# EAGLE schematic MMU_V101r4 (EAGLE 6.6.0)

## Sheet 1 of 4
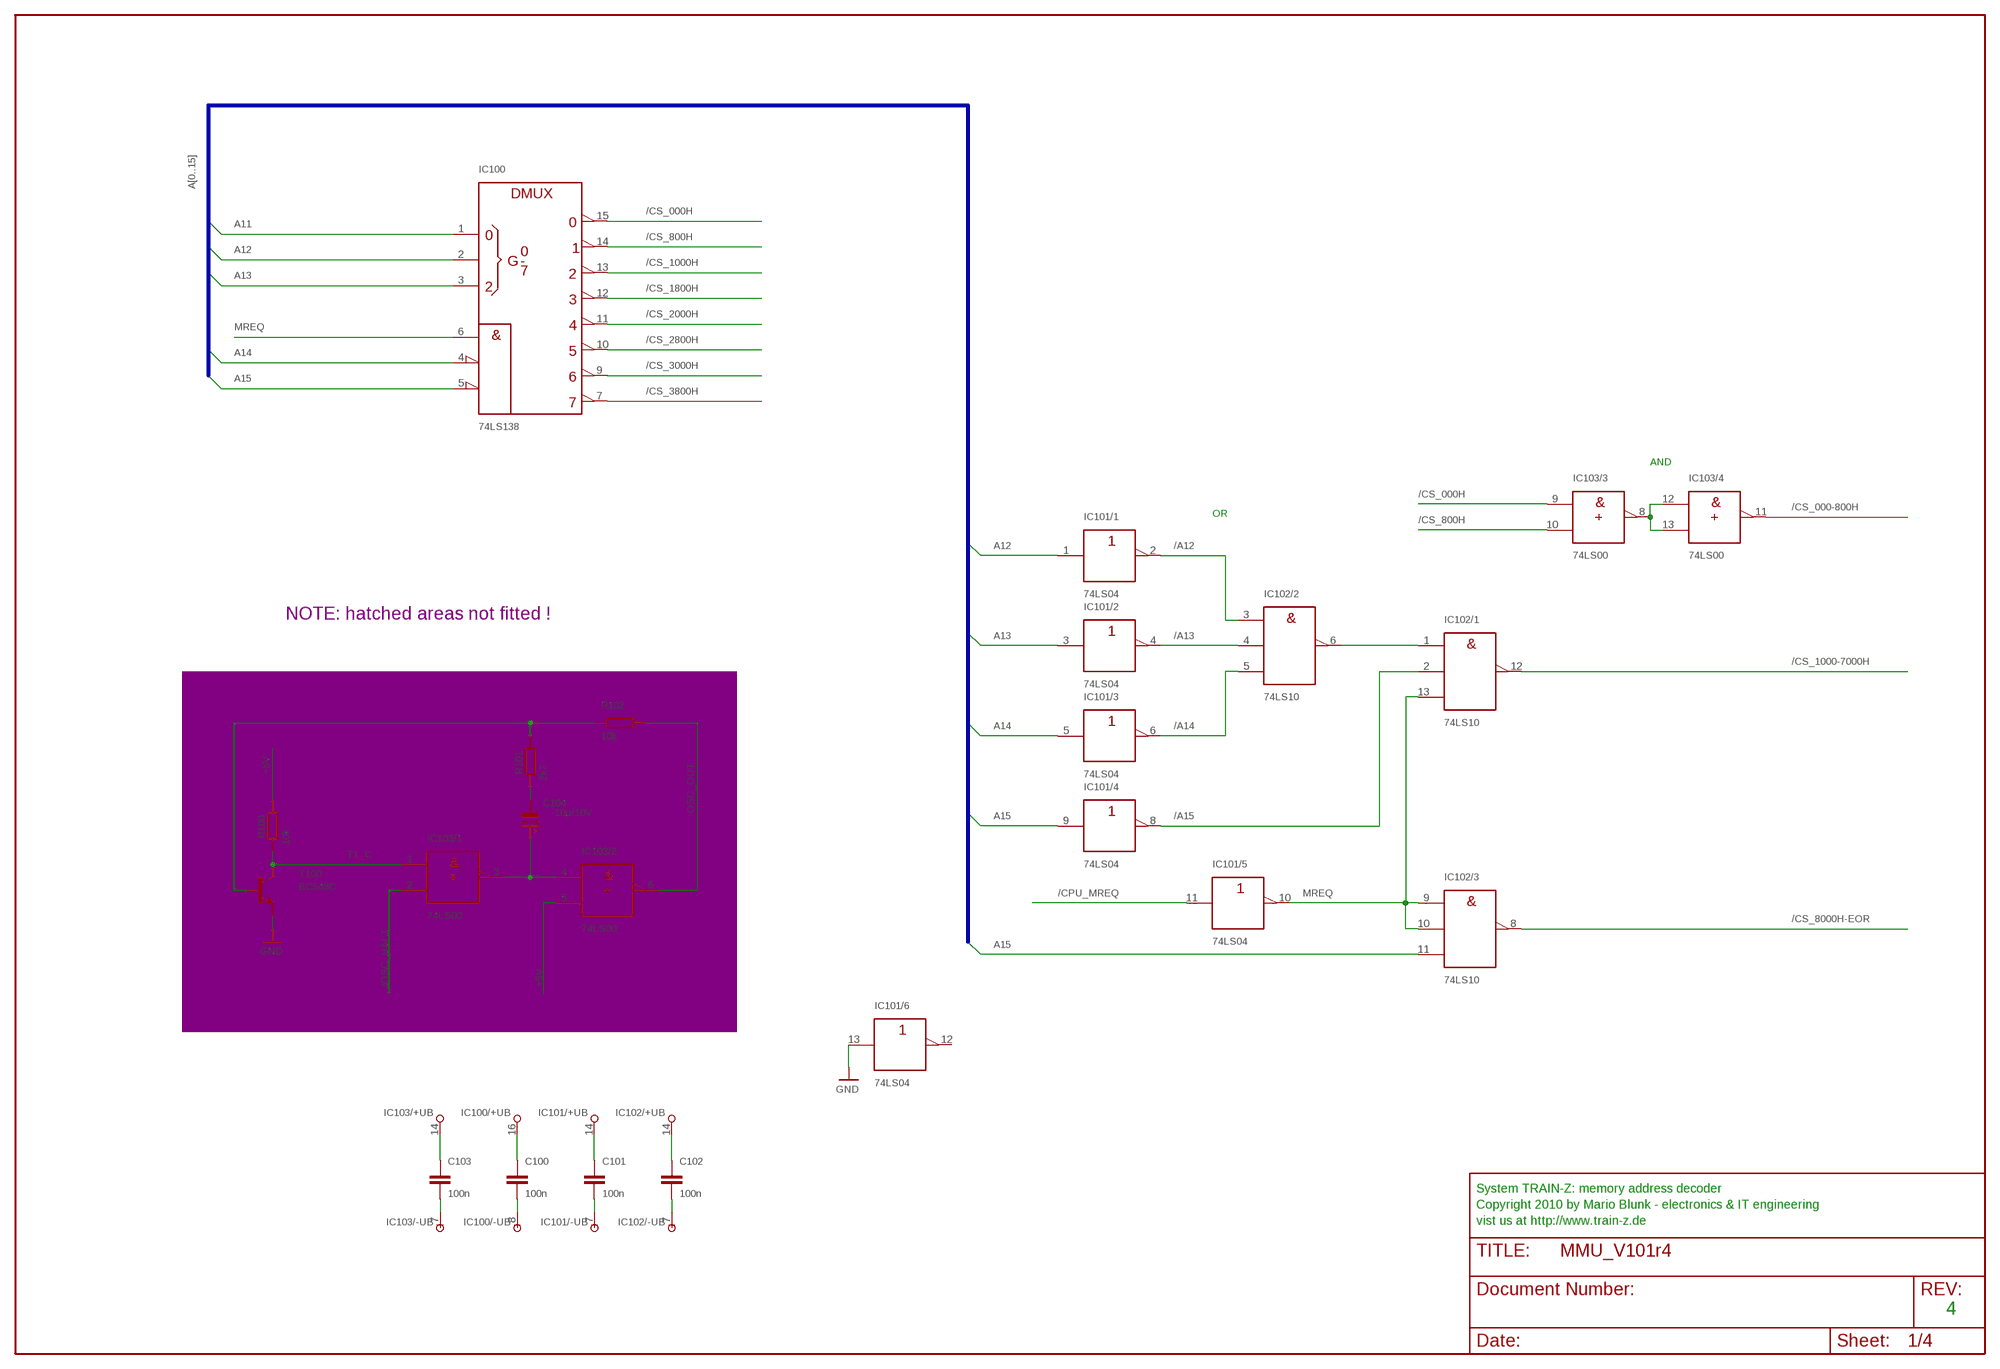
[diagram p0: schematic, sheet 1]

### Parts
C100  100n  C-EU050-030X075  [C050-030X075]
C101  100n  C-EU050-030X075  [C050-030X075]
C102  100n  C-EU050-030X075  [C050-030X075]
C103  100n  C-EU050-030X075  [C050-030X075]
C104  10µ/10V  CPOL-EUE2.5-7  [E2,5-7]
IC100  74LS138  74138N  [DIL16]
IC101  74LS04  7404N  [DIL14]
IC102  74LS10  7410N  [DIL14]
IC103  74LS00  74LS00N  [DIL14]
R100  10k  R-EU_0207/10  [0207/10]
R101  2k7  R-EU_0207/10  [0207/10]
R102  10k  R-EU_0207/10  [0207/10]
T100  BC548C  BC547  [TO92]

### Nets
+5V [+5V]: C100.1 C101.1 C102.1 C103.1 IC100.16(+UB) IC101.14(/+UB:+UB) IC102.14(/+UB:+UB) IC103.5(/2:B) IC103.14(/+UB:+UB) R100.2 ; also sheet 2,3,4
/A12: IC101.2(/1:Y) IC102.3(/2:A)
/A13: IC101.4(/2:Y) IC102.4(/2:B)
/A14: IC101.6(/3:Y) IC102.5(/2:C)
/A15: IC101.8(/4:Y) IC102.2(/1:B)
/CPU_MREQ: IC101.11(/5:A) ; also sheet 3,4
/CS_000-800H: IC103.11(/4:Y) ; also sheet 2,3,4
/CS_000H: IC100.15(Y0) IC103.9(/3:A)
/CS_800H: IC100.14(Y1) IC103.10(/3:B)
/CS_1000-7000H: IC102.12(/1:Y) ; also sheet 2,3,4
/CS_1000H: IC100.13(Y2)
/CS_1800H: IC100.12(Y3)
/CS_2000H: IC100.11(Y4)
/CS_2800H: IC100.10(Y5)
/CS_3000H: IC100.9(Y6)
/CS_3800H: IC100.7(Y7)
/CS_8000H-EOR: IC102.8(/3:Y) ; also sheet 2,3,4
/OSC_HALT: IC103.2(/1:B) ; also sheet 3,4
A11: IC100.1(A) ; also sheet 2,3,4
A12: IC100.2(B) IC101.1(/1:A) ; also sheet 2,3,4
A12ORA13ORA14: IC102.1(/1:A) IC102.6(/2:Y)
A13: IC100.3(C) IC101.3(/2:A) ; also sheet 2,3,4
A14: IC100.4(!G2A) IC101.5(/3:A) ; also sheet 2,3,4
A15: IC100.5(!G2B) IC101.9(/4:A) IC102.11(/3:C) ; also sheet 3,4
C14+: C104.+ IC103.3(/1:Y) IC103.4(/2:A)
C14-: C104.- R101.1
CS_000-800H: IC103.8(/3:Y) IC103.12(/4:A) IC103.13(/4:B)
GND [GND]: C100.2 C101.2 C102.2 C103.2 IC100.8(-UB) IC101.7(/-UB:-UB) IC101.13(/6:A) IC102.7(/-UB:-UB) IC103.7(/-UB:-UB) T100.1(E) ; also sheet 2,3,4
MREQ: IC100.6(G1) IC101.10(/5:Y) IC102.9(/3:A) IC102.10(/3:B) IC102.13(/1:C)
OSC_OUT: IC103.6(/2:Y) R102.2 ; also sheet 3,4
T1_B: R101.2 R102.1 T100.2(B)
T1_C: IC103.1(/1:A) R100.1 T100.3(C)
Unconnected: IC101.12(/6:Y)

### Buses
A[0..15]

### Notes on the sheet
- AND
- OR
- NOTE: hatched areas not fitted !
- System TRAIN-Z: memory address decoder
- Copyright 2010 by Mario Blunk - electronics & IT engineering
- vist us at http://www.train-z.de
- 4

## Sheet 2 of 4
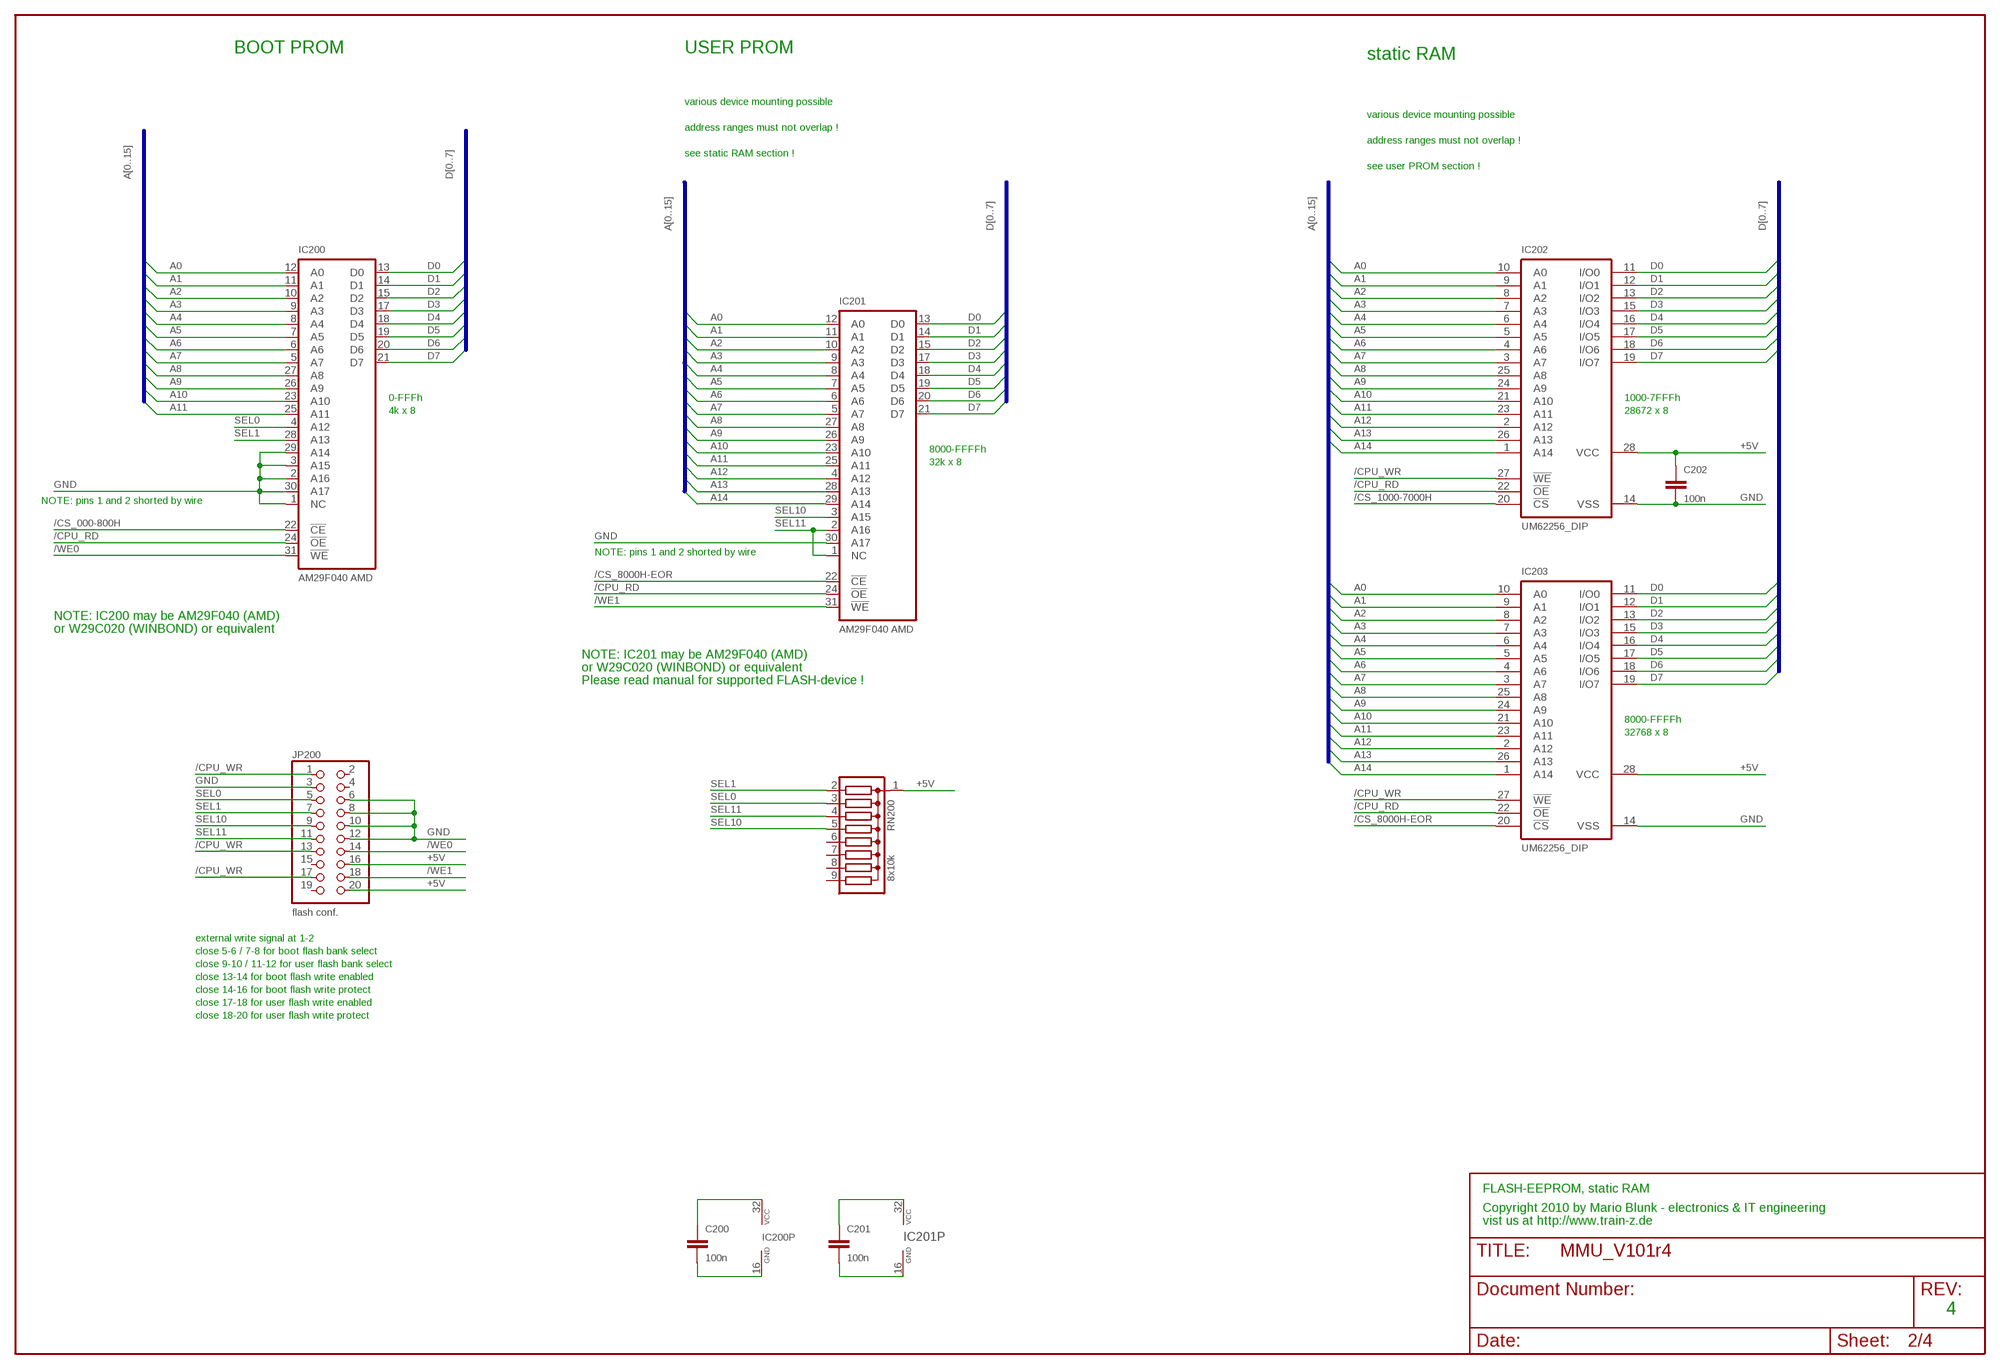
[diagram p1: schematic, sheet 2]

### Parts
C200  100n  C-EU050-030X075  [C050-030X075]
C201  100n  C-EU050-030X075  [C050-030X075]
C202  100n  C-EU050-030X075  [C050-030X075]
IC200  AM29F040 AMD  W29C020  [DIL32]
IC201  AM29F040 AMD  W29C020  [DIL32]
IC202  UM62256_DIP  62256P  [DIL28-6]
IC203  UM62256_DIP  62256P  [DIL28-6]
JP200  flash conf.  PINHD-2X10  [2X10]
RN200  8x10k  G08R  [SIL9]

### Nets
+5V [+5V]: C200.1 C201.1 C202.1 IC200.32(VCC) IC201.32(VCC) IC202.28(VCC) IC203.28(VCC) JP200.16 JP200.20 RN200.1 ; also sheet 1,3,4
/CPU_RD: IC200.24(!OE) IC201.24(!OE) IC202.22(!OE) IC203.22(!OE) ; also sheet 3,4
/CPU_WR: IC202.27(!WE) IC203.27(!WE) JP200.1 JP200.13 JP200.17 ; also sheet 3,4
/CS_000-800H: IC200.22(!CE) ; also sheet 1,3,4
/CS_1000-7000H: IC202.20(!CS) ; also sheet 1,3,4
/CS_8000H-EOR: IC201.22(!CE) IC203.20(!CS) ; also sheet 1,3,4
/WE0: IC200.31(!WE) JP200.14
/WE1: IC201.31(!WE) JP200.18
A0: IC200.12(A0) IC201.12(A0) IC202.10(A0) IC203.10(A0) ; also sheet 3,4
A1: IC200.11(A1) IC201.11(A1) IC202.9(A1) IC203.9(A1) ; also sheet 3,4
A2: IC200.10(A2) IC201.10(A2) IC202.8(A2) IC203.8(A2) ; also sheet 3,4
A3: IC200.9(A3) IC201.9(A3) IC202.7(A3) IC203.7(A3) ; also sheet 3,4
A4: IC200.8(A4) IC201.8(A4) IC202.6(A4) IC203.6(A4) ; also sheet 3,4
A5: IC200.7(A5) IC201.7(A5) IC202.5(A5) IC203.5(A5) ; also sheet 3,4
A6: IC200.6(A6) IC201.6(A6) IC202.4(A6) IC203.4(A6) ; also sheet 3,4
A7: IC200.5(A7) IC201.5(A7) IC202.3(A7) IC203.3(A7) ; also sheet 3,4
A8: IC200.27(A8) IC201.27(A8) IC202.25(A8) IC203.25(A8) ; also sheet 3,4
A9: IC200.26(A9) IC201.26(A9) IC202.24(A9) IC203.24(A9) ; also sheet 3,4
A10: IC200.23(A10) IC201.23(A10) IC202.21(A10) IC203.21(A10) ; also sheet 3,4
A11: IC200.25(A11) IC201.25(A11) IC202.23(A11) IC203.23(A11) ; also sheet 1,3,4
A12: IC201.4(A12) IC202.2(A12) IC203.2(A12) ; also sheet 1,3,4
A13: IC201.28(A13) IC202.26(A13) IC203.26(A13) ; also sheet 1,3,4
A14: IC201.29(A14) IC202.1(A14) IC203.1(A14) ; also sheet 1,3,4
D0: IC200.13(D0) IC201.13(D0) IC202.11(I/O0) IC203.11(I/O0) ; also sheet 3,4
D1: IC200.14(D1) IC201.14(D1) IC202.12(I/O1) IC203.12(I/O1) ; also sheet 3,4
D2: IC200.15(D2) IC201.15(D2) IC202.13(I/O2) IC203.13(I/O2) ; also sheet 3,4
D3: IC200.17(D3) IC201.17(D3) IC202.15(I/O3) IC203.15(I/O3) ; also sheet 3,4
D4: IC200.18(D4) IC201.18(D4) IC202.16(I/O4) IC203.16(I/O4) ; also sheet 3,4
D5: IC200.19(D5) IC201.19(D5) IC202.17(I/O5) IC203.17(I/O5) ; also sheet 3,4
D6: IC200.20(D6) IC201.20(D6) IC202.18(I/O6) IC203.18(I/O6) ; also sheet 3,4
D7: IC200.21(D7) IC201.21(D7) IC202.19(I/O7) IC203.19(I/O7) ; also sheet 3,4
GND [GND]: C200.2 C201.2 C202.2 IC200.1(NC) IC200.2(A16) IC200.3(A15) IC200.16(GND) IC200.29(A14) IC200.30(A17) IC201.16(GND) IC201.30(A17) IC202.14(VSS) IC203.14(VSS) JP200.3 JP200.6 JP200.8 JP200.10 JP200.12 ; also sheet 1,3,4
SEL0: IC200.4(A12) JP200.5 RN200.3
SEL1: IC200.28(A13) JP200.7 RN200.2
SEL10: IC201.3(A15) JP200.9 RN200.5
SEL11: IC201.1(NC) IC201.2(A16) JP200.11 RN200.4
Unconnected: JP200.2 JP200.4 JP200.15 JP200.19 RN200.6 RN200.7 RN200.8 RN200.9

### Buses
A[0..15]
D[0..7]

### Notes on the sheet
- BOOT PROM | USER PROM
- static RAM
- various device mounting possible
- various device mounting possible
- address ranges must not overlap !
- address ranges must not overlap !
- see static RAM section !
- see user PROM section !
- 0-FFFh | 1000-7FFFh
- 4k x 8 | 28672 x 8
- 8000-FFFFh
- 32k x 8
- NOTE: pins 1 and 2 shorted by wire
- NOTE: pins 1 and 2 shorted by wire
- NOTE: IC200 may be AM29F040 (AMD)
- or W29C020 (WINBOND) or equivalent
- NOTE: IC201 may be AM29F040 (AMD)
- or W29C020 (WINBOND) or equivalent
- Please read manual for supported FLASH-device !
- 8000-FFFFh
- 32768 x 8
- external write signal at 1-2
- close 5-6 / 7-8 for boot flash bank select
- close 9-10 / 11-12 for user flash bank select
- close 13-14 for boot flash write enabled
- close 14-16 for boot flash write protect
- close 17-18 for user flash write enabled
- close 18-20 for user flash write protect
- FLASH-EEPROM, static RAM
- Copyright 2010 by Mario Blunk - electronics & IT engineering
- vist us at http://www.train-z.de
- 4

## Sheet 3 of 4
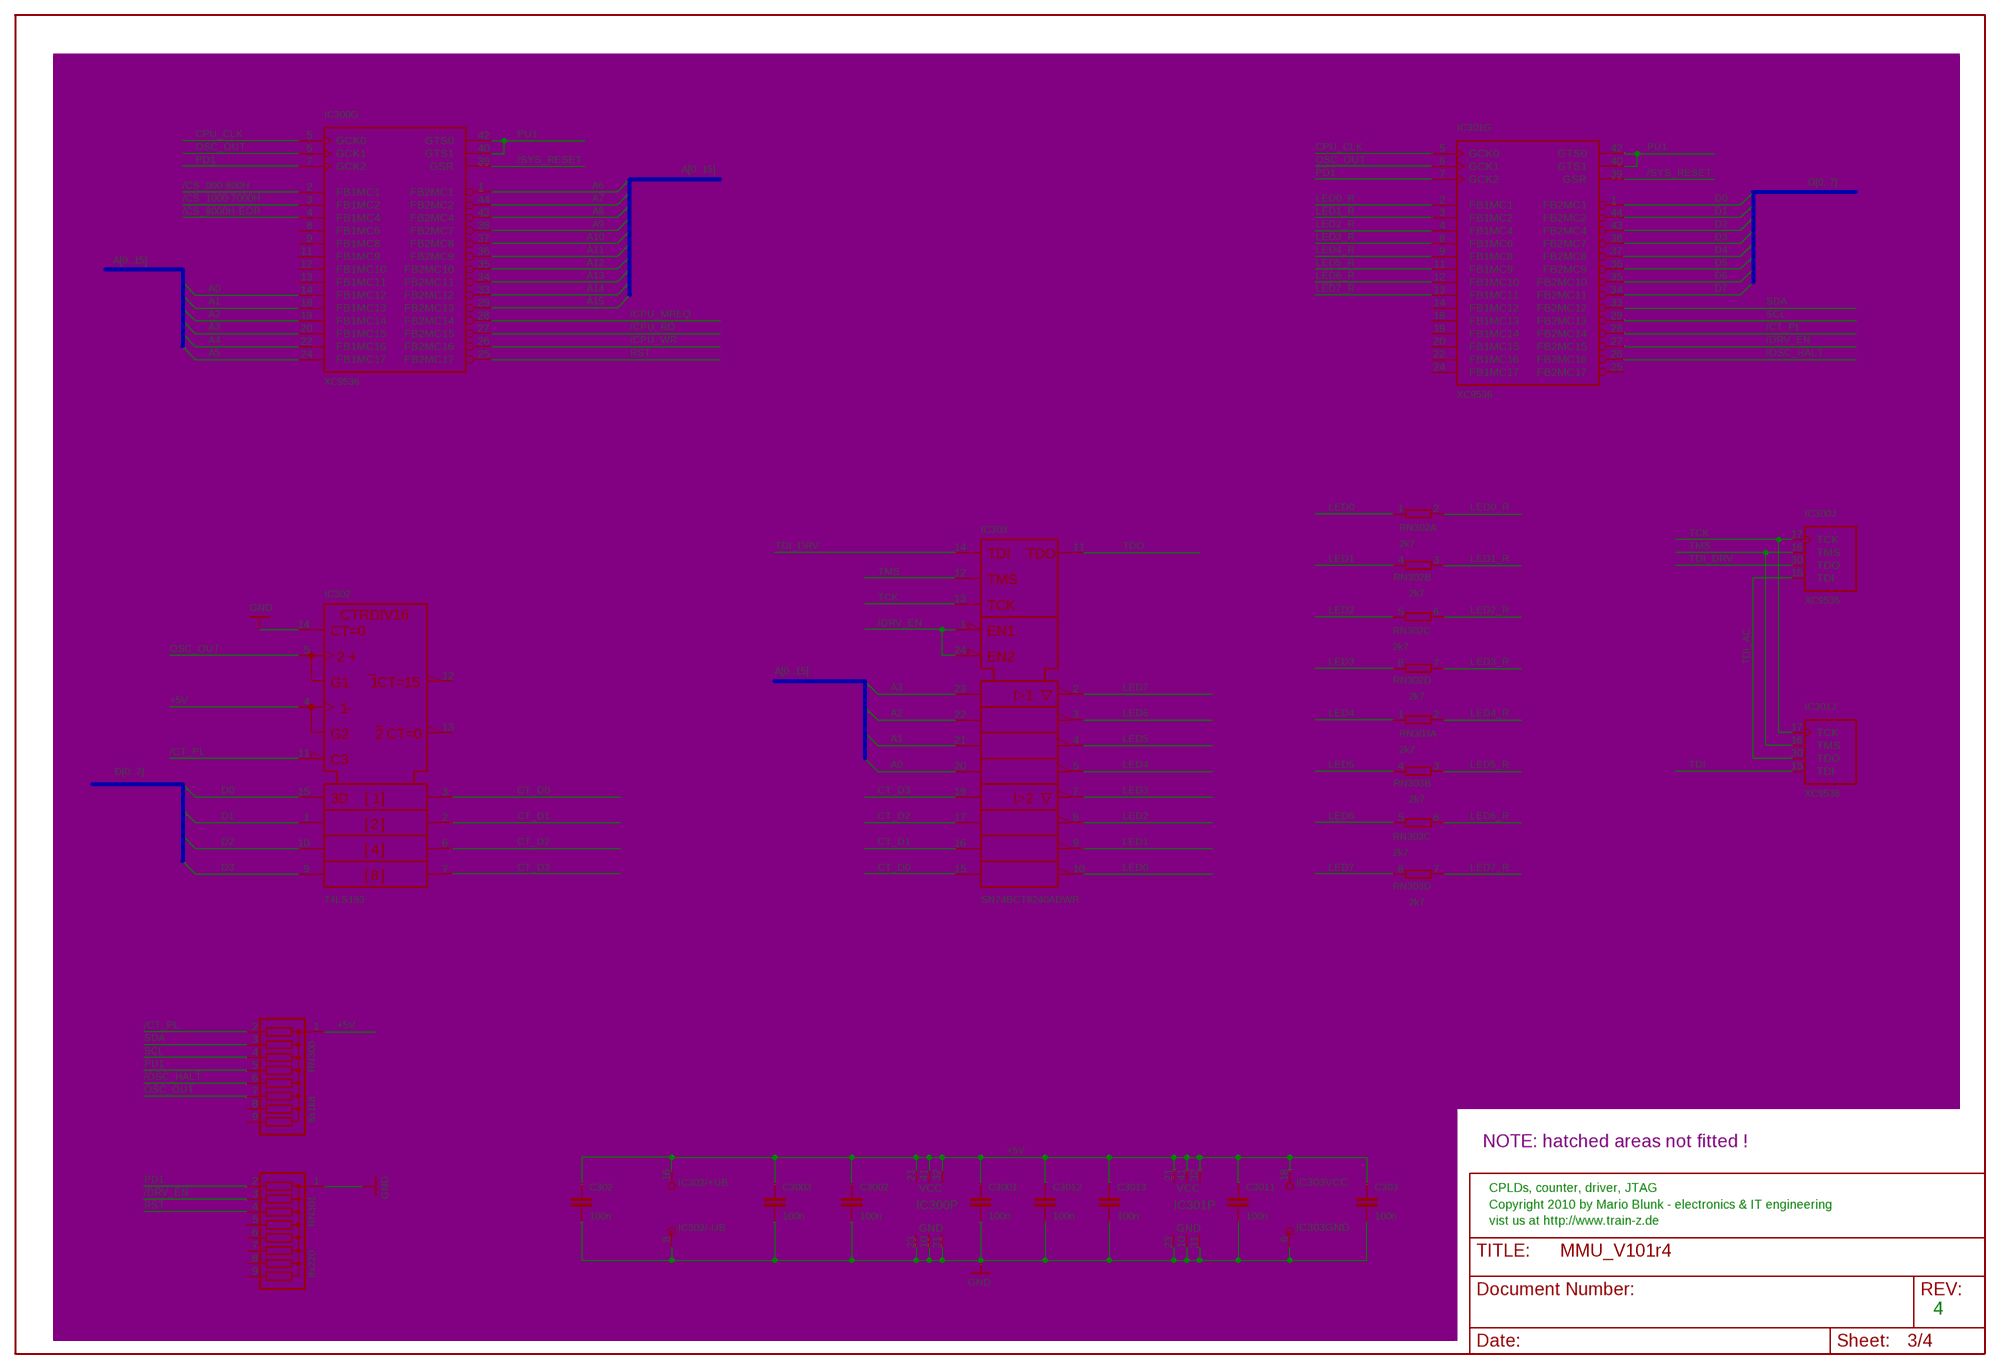
[diagram p2: schematic, sheet 3]

### Parts
C302  100n  C-EU050-025X075  [C050-025X075]
C303  100n  C-EU050-030X075  [C050-030X075]
C3001  100n  C-EU050-030X075  [C050-030X075]
C3002  100n  C-EU050-030X075  [C050-030X075]
C3003  100n  C-EU050-030X075  [C050-030X075]
C3011  100n  C-EU050-030X075  [C050-030X075]
C3012  100n  C-EU050-030X075  [C050-030X075]
C3013  100n  C-EU050-030X075  [C050-030X075]
IC300  XC9536  XC9536-44  [PLCC-S44]
IC301  XC9536  XC9536-44  [PLCC-S44]
IC302  74LS193  74193N  [DIL16]
IC303  SN74BCT8240ADWR  [SOIC24]
RN300  8x1k8  G08R  [SIL9]
RN301  8x220  G08R  [SIL9]
RN302  2k7  E4R  [SIL8]
RN303  2k7  E4R  [SIL8]

### Nets
+5V [+5V]: C302.1 C303.1 C3001.1 C3002.1 C3003.1 C3011.1 C3012.1 C3013.1 IC300.21(P:VCC) IC300.32(P:VCC) IC300.41(P:VCC) IC301.21(P:VCC) IC301.32(P:VCC) IC301.41(P:VCC) IC302.4(DOWN) IC302.16(+UB) IC303.18(+UB) RN300.1 ; also sheet 1,2,4
/CPU_MREQ: IC300.28(G:FB2MC14) ; also sheet 1,4
/CPU_RD: IC300.27(G:FB2MC15) ; also sheet 2,4
/CPU_WR: IC300.26(G:FB2MC16) ; also sheet 2,4
/CS_000-800H: IC300.2(G:FB1MC1) ; also sheet 1,2,4
/CS_1000-7000H: IC300.3(G:FB1MC2) ; also sheet 1,2,4
/CS_8000H-EOR: IC300.4(G:FB1MC4) ; also sheet 1,2,4
/CT_PL: IC301.28(G:FB2MC14) IC302.11(!LOAD) RN300.2 ; also sheet 4
/DRV_EN: IC301.27(G:FB2MC15) IC303.1(/EN1) IC303.24(/EN2) RN301.3 ; also sheet 4
/OSC_HALT: IC301.26(G:FB2MC16) RN300.6 ; also sheet 1,4
/SYS_RESET: IC300.39(G:GSR) IC301.39(G:GSR) ; also sheet 4
A0: IC300.14(G:FB1MC12) IC303.20(A4) ; also sheet 2,4
A1: IC300.18(G:FB1MC13) IC303.21(A3) ; also sheet 2,4
A2: IC300.19(G:FB1MC14) IC303.22(A2) ; also sheet 2,4
A3: IC300.20(G:FB1MC15) IC303.23(A1) ; also sheet 2,4
A4: IC300.22(G:FB1MC16) ; also sheet 2,4
A5: IC300.24(G:FB1MC17) ; also sheet 2,4
A6: IC300.1(G:FB2MC1) ; also sheet 2,4
A7: IC300.44(G:FB2MC2) ; also sheet 2,4
A8: IC300.43(G:FB2MC4) ; also sheet 2,4
A9: IC300.38(G:FB2MC7) ; also sheet 2,4
A10: IC300.37(G:FB2MC8) ; also sheet 2,4
A11: IC300.36(G:FB2MC9) ; also sheet 1,2,4
A12: IC300.35(G:FB2MC10) ; also sheet 1,2,4
A13: IC300.34(G:FB2MC11) ; also sheet 1,2,4
A14: IC300.33(G:FB2MC12) ; also sheet 1,2,4
A15: IC300.29(G:FB2MC13) ; also sheet 1,4
CPU_CLK: IC300.5(G:GCK0) IC301.5(G:GCK0) ; also sheet 4
CT_D0: IC302.3(QA) IC303.15(A8) ; also sheet 4
CT_D1: IC302.2(QB) IC303.16(A7) ; also sheet 4
CT_D2: IC302.6(QC) IC303.17(A6) ; also sheet 4
CT_D3: IC302.7(QD) IC303.19(A5) ; also sheet 4
D0: IC301.1(G:FB2MC1) IC302.15(A) ; also sheet 2,4
D1: IC301.44(G:FB2MC2) IC302.1(B) ; also sheet 2,4
D2: IC301.43(G:FB2MC4) IC302.10(C) ; also sheet 2,4
D3: IC301.38(G:FB2MC7) IC302.9(D) ; also sheet 2,4
D4: IC301.37(G:FB2MC8) ; also sheet 2,4
D5: IC301.36(G:FB2MC9) ; also sheet 2,4
D6: IC301.35(G:FB2MC10) ; also sheet 2,4
D7: IC301.34(G:FB2MC11) ; also sheet 2,4
GND [GND]: C302.2 C303.2 C3001.2 C3002.2 C3003.2 C3011.2 C3012.2 C3013.2 IC300.10(P:GND) IC300.23(P:GND) IC300.31(P:GND) IC301.10(P:GND) IC301.23(P:GND) IC301.31(P:GND) IC302.8(-UB) IC302.14(CLR) IC303.6(-UB) RN301.1 ; also sheet 1,2,4
LED0: IC303.10(/Y8) RN302.1 ; also sheet 4
LED0_R: IC301.2(G:FB1MC1) RN302.2 ; also sheet 4
LED1: IC303.9(/Y7) RN302.4 ; also sheet 4
LED1_R: IC301.3(G:FB1MC2) RN302.3 ; also sheet 4
LED2: IC303.8(/Y6) RN302.5 ; also sheet 4
LED2_R: IC301.4(G:FB1MC4) RN302.6 ; also sheet 4
LED3: IC303.7(/Y5) RN302.8 ; also sheet 4
LED3_R: IC301.8(G:FB1MC6) RN302.7 ; also sheet 4
LED4: IC303.5(/Y4) RN303.1 ; also sheet 4
LED4_R: IC301.9(G:FB1MC8) RN303.2 ; also sheet 4
LED5: IC303.4(/Y3) RN303.4 ; also sheet 4
LED5_R: IC301.11(G:FB1MC9) RN303.3 ; also sheet 4
LED6: IC303.3(/Y2) RN303.5 ; also sheet 4
LED6_R: IC301.12(G:FB1MC10) RN303.6 ; also sheet 4
LED7: IC303.2(/Y1) RN303.8 ; also sheet 4
LED7_R: IC301.13(G:FB1MC11) RN303.7 ; also sheet 4
OSC_OUT: IC300.6(G:GCK1) IC301.6(G:GCK1) IC302.5(UP) RN300.7 ; also sheet 1,4
PD1: IC300.7(G:GCK2) IC301.7(G:GCK2) RN301.2 ; also sheet 4
PU1: IC300.40(G:GTS1) IC300.42(G:GTS0) IC301.40(G:GTS1) IC301.42(G:GTS0) RN300.5 ; also sheet 4
RST: IC300.25(G:FB2MC17) RN301.4 ; also sheet 4
SCL: IC301.29(G:FB2MC13) RN300.4 ; also sheet 4
SDA: IC301.33(G:FB2MC12) RN300.3 ; also sheet 4
TCK: IC300.17(J:TCK) IC301.17(J:TCK) IC303.13(TCK) ; also sheet 4
TDI: IC301.15(J:TDI) ; also sheet 4
TDI_AC: IC300.15(J:TDI) IC301.30(J:TDO) ; also sheet 4
TDI_DRV: IC300.30(J:TDO) IC303.14(TDI) ; also sheet 4
TDO: IC303.11(TDO) ; also sheet 4
TMS: IC300.16(J:TMS) IC301.16(J:TMS) IC303.12(TMS) ; also sheet 4
Unconnected: IC300.8(G:FB1MC6) IC300.9(G:FB1MC8) IC300.11(G:FB1MC9) IC300.12(G:FB1MC10) IC300.13(G:FB1MC11) IC301.14(G:FB1MC12) IC301.18(G:FB1MC13) IC301.19(G:FB1MC14) IC301.20(G:FB1MC15) IC301.22(G:FB1MC16) IC301.24(G:FB1MC17) IC301.25(G:FB2MC17) IC302.12(!CO) IC302.13(!BO) RN300.8 RN300.9 RN301.5 RN301.6 RN301.7 RN301.8 RN301.9

### Buses
A[0..15]
D[0..7]

### Notes on the sheet
- NOTE: hatched areas not fitted !
- CPLDs, counter, driver, JTAG
- Copyright 2010 by Mario Blunk - electronics & IT engineering
- vist us at http://www.train-z.de
- 4

## Sheet 4 of 4
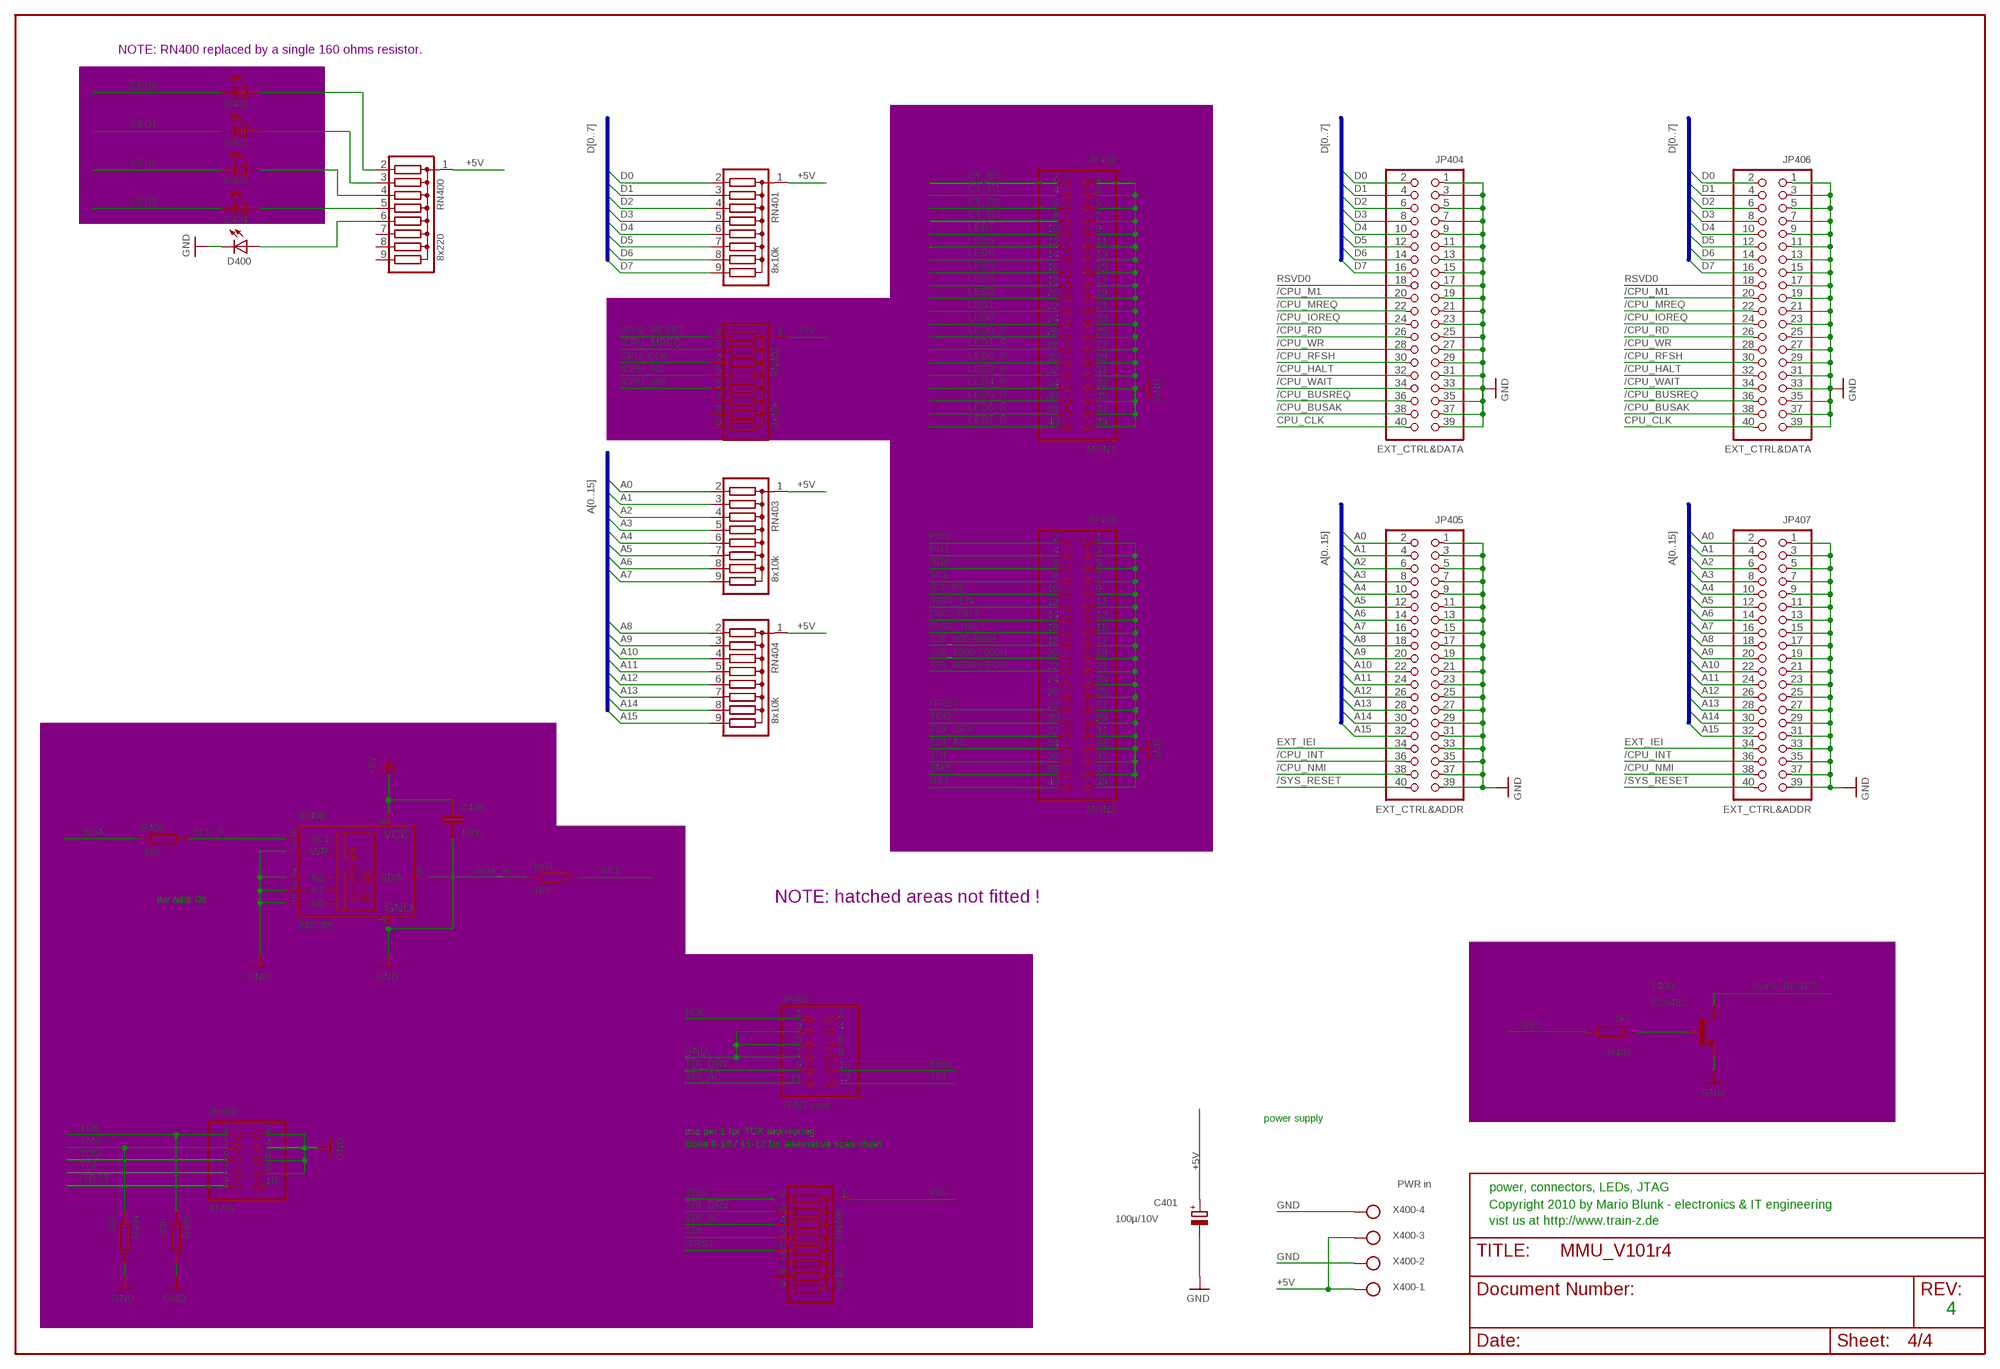
[diagram p3: schematic, sheet 4]

### Parts
C400  100n  C-EU050-030X075  [C050-030X075]
C401  100µ/10V  CPOL-EUE2.5-7  [E2,5-7]
D400  LED5MM  [LED5MM]
D401  LED5MM  [LED5MM]
D402  LED5MM  [LED5MM]
D403  LED5MM  [LED5MM]
D404  LED5MM  [LED5MM]
IC400  24C08P  24C64P  [DIL8]
JP400  JTAG  PINHD-2X5  [2X05]
JP401  JTAG conf.  PINHD-2X6  [2X06]
JP402  MON1  PINHD-2X20  [2X20]
JP403  MON2  PINHD-2X20  [2X20]
JP404  EXT_CTRL&DATA  PINHD-2X20  [2X20]
JP405  EXT_CTRL&ADDR  PINHD-2X20  [2X20]
JP406  EXT_CTRL&DATA  PINHD-2X20  [2X20]
JP407  EXT_CTRL&ADDR  PINHD-2X20  [2X20]
R400  160  R-EU_0207/10  [0207/10]
R401  160  R-EU_0207/10  [0207/10]
R402  2k7  R-EU_0207/10  [0207/10]
R404  330  R-EU_0207/10  [0207/10]
R405  330  R-EU_0207/10  [0207/10]
RN400  8x220  G08R  [SIL9]
RN401  8x10k  G08R  [SIL9]
RN402  8x10k  G08R  [SIL9]
RN403  8x10k  G08R  [SIL9]
RN404  8x10k  G08R  [SIL9]
RN405  8x4k7  G08R  [SIL9]
T400  BC548C  BC547  [TO92]
X400  PWR in  W237-4  [W237-4]

### Nets
+5V [+5V]: C400.1 C401.+ IC400.8(VCC) RN400.1 RN401.1 RN402.1 RN403.1 RN404.1 RN405.1 X400.1 X400.3 ; also sheet 1,2,3
/CPU_BUSAK: JP404.38 JP406.38
/CPU_BUSREQ: JP404.36 JP406.36
/CPU_HALT: JP404.32 JP406.32
/CPU_INT: JP405.36 JP407.36
/CPU_IOREQ: JP404.24 JP406.24
/CPU_M1: JP404.20 JP406.20
/CPU_MREQ: JP404.22 JP406.22 RN402.3 ; also sheet 1,3
/CPU_NMI: JP405.38 JP407.38
/CPU_RD: JP404.26 JP406.26 RN402.5 ; also sheet 2,3
/CPU_RFSH: JP404.30 JP406.30
/CPU_WAIT: JP404.34 JP406.34
/CPU_WR: JP404.28 JP406.28 RN402.6 ; also sheet 2,3
/CS_000-800H: JP403.18 ; also sheet 1,2,3
/CS_1000-7000H: JP403.20 ; also sheet 1,2,3
/CS_8000H-EOR: JP403.22 ; also sheet 1,2,3
/CT_PL: JP403.10 ; also sheet 3
/DRV_EN: JP403.12 ; also sheet 3
/OSC_HALT: JP403.16 ; also sheet 1,3
/SYS_RESET: JP405.40 JP407.40 RN402.2 T400.3(C) ; also sheet 3
/TRST: JP400.9 JP403.28 RN405.6
A0: JP405.2 JP407.2 RN403.2 ; also sheet 2,3
A1: JP405.4 JP407.4 RN403.3 ; also sheet 2,3
A2: JP405.6 JP407.6 RN403.4 ; also sheet 2,3
A3: JP405.8 JP407.8 RN403.5 ; also sheet 2,3
A4: JP405.10 JP407.10 RN403.6 ; also sheet 2,3
A5: JP405.12 JP407.12 RN403.7 ; also sheet 2,3
A6: JP405.14 JP407.14 RN403.8 ; also sheet 2,3
A7: JP405.16 JP407.16 RN403.9 ; also sheet 2,3
A8: JP405.18 JP407.18 RN404.2 ; also sheet 2,3
A9: JP405.20 JP407.20 RN404.3 ; also sheet 2,3
A10: JP405.22 JP407.22 RN404.4 ; also sheet 2,3
A11: JP405.24 JP407.24 RN404.5 ; also sheet 1,2,3
A12: JP405.26 JP407.26 RN404.6 ; also sheet 1,2,3
A13: JP405.28 JP407.28 RN404.7 ; also sheet 1,2,3
A14: JP405.30 JP407.30 RN404.8 ; also sheet 1,2,3
A15: JP405.32 JP407.32 RN404.9 ; also sheet 1,3
CPU_CLK: JP404.40 JP406.40 RN402.4 ; also sheet 3
CT_D0: JP402.2 ; also sheet 3
CT_D1: JP402.4 ; also sheet 3
CT_D2: JP402.6 ; also sheet 3
CT_D3: JP402.8 ; also sheet 3
D0: JP404.2 JP406.2 RN401.2 ; also sheet 2,3
D1: JP404.4 JP406.4 RN401.3 ; also sheet 2,3
D2: JP404.6 JP406.6 RN401.4 ; also sheet 2,3
D3: JP404.8 JP406.8 RN401.5 ; also sheet 2,3
D4: JP404.10 JP406.10 RN401.6 ; also sheet 2,3
D4_A: D400.A RN400.6
D5: JP404.12 JP406.12 RN401.7 ; also sheet 2,3
D6: JP404.14 JP406.14 RN401.8 ; also sheet 2,3
D7: JP404.16 JP406.16 RN401.9 ; also sheet 2,3
EXT_IEI: JP405.34 JP407.34
GND [GND]: C400.2 C401.- D400.K(C) IC400.1(A0) IC400.2(A1) IC400.3(A2) IC400.4(GND) IC400.7(WP) JP400.2 JP400.4 JP400.6 JP400.8 JP401.3 JP401.5 JP401.7 JP402.1 JP402.3 JP402.5 JP402.7 JP402.9 JP402.11 JP402.13 JP402.15 JP402.17 JP402.19 JP402.21 JP402.23 JP402.25 JP402.27 JP402.29 JP402.31 JP402.33 JP402.35 JP402.37 JP402.39 JP403.1 JP403.3 JP403.5 JP403.7 JP403.9 JP403.11 JP403.13 JP403.15 JP403.17 JP403.19 JP403.21 JP403.23 JP403.25 JP403.27 JP403.29 JP403.31 JP403.33 JP403.35 JP403.37 JP403.39 JP404.1 JP404.3 JP404.5 JP404.7 JP404.9 JP404.11 JP404.13 JP404.15 JP404.17 JP404.19 JP404.21 JP404.23 JP404.25 JP404.27 JP404.29 JP404.31 JP404.33 JP404.35 JP404.37 JP404.39 JP405.1 JP405.3 JP405.5 JP405.7 JP405.9 JP405.11 JP405.13 JP405.15 JP405.17 JP405.19 JP405.21 JP405.23 JP405.25 JP405.27 JP405.29 JP405.31 JP405.33 JP405.35 JP405.37 JP405.39 JP406.1 JP406.3 JP406.5 JP406.7 JP406.9 JP406.11 JP406.13 JP406.15 JP406.17 JP406.19 JP406.21 JP406.23 JP406.25 JP406.27 JP406.29 JP406.31 JP406.33 JP406.35 JP406.37 JP406.39 JP407.1 JP407.3 JP407.5 JP407.7 JP407.9 JP407.11 JP407.13 JP407.15 JP407.17 JP407.19 JP407.21 JP407.23 JP407.25 JP407.27 JP407.29 JP407.31 JP407.33 JP407.35 JP407.37 JP407.39 R404.2 R405.2 T400.1(E) X400.2 X400.4 ; also sheet 1,2,3
LED0: D401.K(C) JP402.24 ; also sheet 3
LED0_K: D401.A RN400.2
LED0_R: JP402.26 ; also sheet 3
LED1: D402.K(C) JP402.22 ; also sheet 3
LED1_K: D402.A RN400.3
LED1_R: JP402.28 ; also sheet 3
LED2: D403.K(C) JP402.20 ; also sheet 3
LED2_K: D403.A RN400.4
LED2_R: JP402.30 ; also sheet 3
LED3: D404.K(C) JP402.18 ; also sheet 3
LED3_K: D404.A RN400.5
LED3_R: JP402.32 ; also sheet 3
LED4: JP402.16 ; also sheet 3
LED4_R: JP402.34 ; also sheet 3
LED5: JP402.14 ; also sheet 3
LED5_R: JP402.36 ; also sheet 3
LED6: JP402.12 ; also sheet 3
LED6_R: JP402.38 ; also sheet 3
LED7: JP402.10 ; also sheet 3
LED7_R: JP402.40 ; also sheet 3
OSC_OUT: JP403.14 ; also sheet 1,3
PD1: JP403.2 ; also sheet 3
PU1: JP403.4 ; also sheet 3
RST: JP403.40 R402.2 ; also sheet 3
RSVD0: JP404.18 JP406.18
SCL: JP403.8 R401.2 ; also sheet 3
SCL_R: IC400.6(SCL) R400.2
SDA: JP403.6 R400.1 ; also sheet 3
SDA_R: IC400.5(SDA) R401.1
T2_B: R402.1 T400.2(B)
TCK: JP400.1 JP401.1 R405.1 ; also sheet 3
TDI: JP400.7 JP401.12 JP403.36 RN405.5 ; also sheet 3
TDI_AC: JP401.11 JP403.34 RN405.4 ; also sheet 3
TDI_DRV: JP401.9 JP403.32 RN405.3 ; also sheet 3
TDO: JP400.5 JP401.10 JP403.30 RN405.2 ; also sheet 3
TMS: JP400.3 JP403.38 R404.1 ; also sheet 3
Unconnected: JP400.10 JP401.2 JP401.4 JP401.6 JP401.8 JP403.24 JP403.26 RN400.7 RN400.8 RN400.9 RN402.7 RN402.8 RN402.9 RN405.7 RN405.8 RN405.9

### Buses
A[0..15]
D[0..7]

### Notes on the sheet
- NOTE: RN400 replaced by a single 160 ohms resistor.
- hw addr 0h | NOTE: hatched areas not fitted !
- power supply
- use pin 1 for TCK monitoring
- close 9-10 / 11-12 for alternative scan chain
- power, connectors, LEDs, JTAG
- Copyright 2010 by Mario Blunk - electronics & IT engineering
- vist us at http://www.train-z.de
- 4

## Library data of the parts
C100-C103 C200-C202 C302 C303 C400 C3001-C3003 C3011-C3013 = rcl:C-EU: CAPACITOR, European symbol
C104 C401 = rcl:CPOL-EU: POLARIZED CAPACITOR, European symbol
D400-D404 = led:LED: LED OSRAM: - CHIPLED LG R971, LG N971, LY N971, LG Q971, LY Q971, LO R971, LY R971 LH N974, LH R974 LS Q976, LO Q976, LY Q976 LO Q996 - Hyper CHIPLED LW Q18S LB Q993, LB Q99A, LB R99A - SideLED LS A670, LO A670, LY A670, LG A670, LP A670 LB A673, LV A673, LT A673, LW A673 LH A674 LY A675 LS A676, LA A676, LO A676, LY A676, LW A676 LS A679, LY A679, LG A679 - Hyper Micro SIDELED® LS Y876, LA Y876, LO Y876, LY Y876 LT Y87S - SmartLED LW L88C, LW L88S LB L89C, LB L89S, LG L890 LS L89K, LO L89K, LY L89K LS L896, LA L896, LO L896, LY L896 - TOPLED LS T670, LO T670, LY T670, LG T670, LP T670 LSG T670, LSP T670, LSY T670, LOP T670, LYG T670 LG T671, LOG T671, LSG T671 LB T673, LV T673, LT T673, LW T673 LH T674 LS T676, LA T676, LO T676, LY T676, LB T676, LH T676, LSB T676, LW T676 LB T67C, LV T67C, LT T67C, LS T67K, LO T67K, LY T67K, LW E67C LS E67B, LA E67B, LO E67B, LY E67B, LB E67C, LV E67C, LT E67C LW T67C LS T679, LY T679, LG T679 LS T770, LO T770, LY T770, LG T770, LP T770 LB T773, LV T773, LT T773, LW T773 LH T774 LS E675, LA E675, LY E675, LS T675 LS T776, LA T776, LO T776, LY T776, LB T776 LHGB T686 LT T68C, LB T68C - Hyper Mini TOPLED® LB M676 - Mini TOPLED Santana® LG M470 LS M47K, LO M47K, LY M47K Source: http://www.osram.convergy.de/
IC100 = 74ttl-din:74*138: 3-line to 8-line DECODER/DEMULTIPLEXER
IC101 = 74ttl-din:74*04: Hex INVERTER
IC102 = 74ttl-din:74*10: Triple 3-input NAND gate
IC103 = 74ttl-din:74*00: Quad 2-input NAND gate
IC200 IC201 = am29-memory_MBL:W29C020: Winbond 256k x 8 Flash Memory
IC202 IC203 = memory-UM:62256P: MEMORY
IC300 IC301 = XILINX:XC9536-44
IC302 = 74ttl-din:74*193: Synchronus 4-bit up down COUNTER
IC303 = TI_SCOPE:SN74BCT8240A: SN54BCT8240A, SN74BCT8240A TI SCAN TEST DEVICES WITH OCTAL INVERTING BUFFERS Version 01 created by MarioBlunk@gmx.net
IC400 = microchip:24*: Serial EEPROM I2C
JP200 = pinhead:PINHD-2X10: PIN HEADER
JP400 = pinhead:PINHD-2X5: PIN HEADER
JP401 = pinhead:PINHD-2X6: PIN HEADER
JP402-JP407 = pinhead:PINHD-2X20: PIN HEADER
R100-R102 R400-R402 R404 R405 = rcl:R-EU_: RESISTOR, European symbol
RN200 RN300 RN301 RN400-RN405 = resistor-sil:G08R: SIL RESISTOR
RN302 RN303 = resistor-sil:E4R: SIL RESISTOR
T100 T400 = transistor:BC547: NPN TRANSISTOR
X400 = con-wago-500:W237-4: WAGO SCREW CLAMP

## Net classes
0 default: width 0.254 mm, clearance 0.203 mm
1 +5V: width 1.016 mm, clearance 0.203 mm
2 GND: width 1.27 mm, clearance 0.203 mm